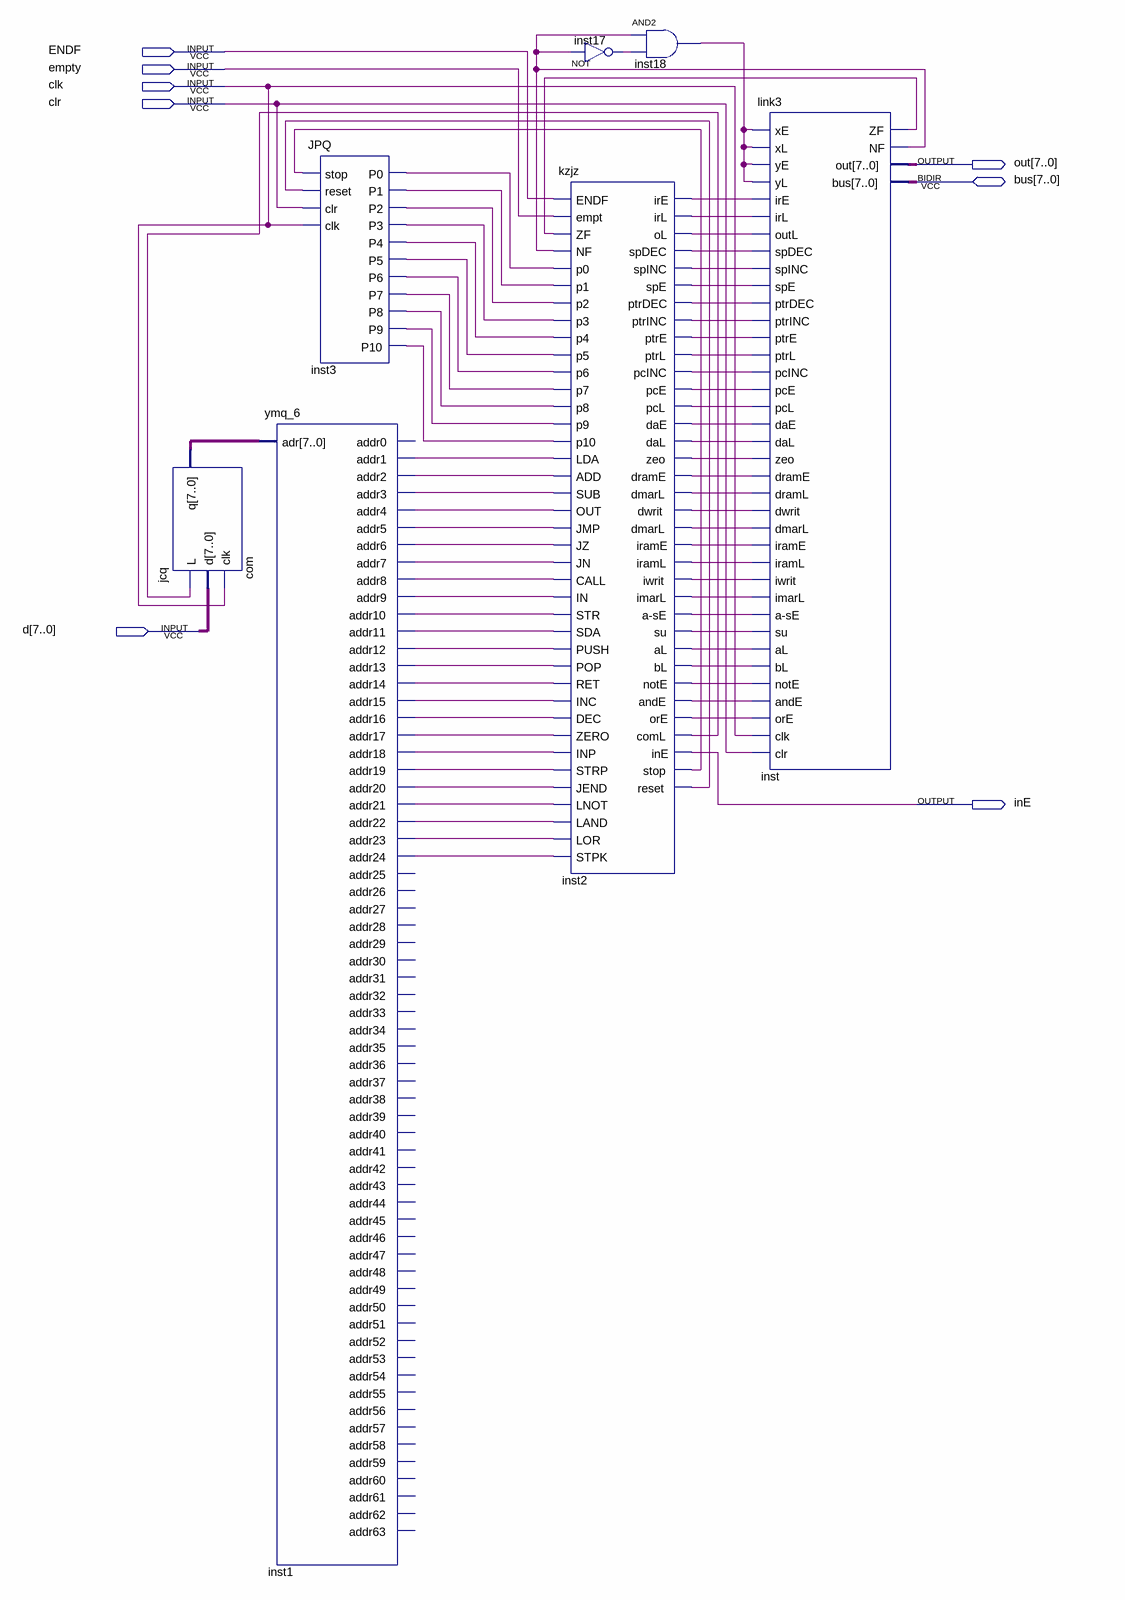
[diagram p0: schematic sheet]
// Quartus schematic top1.bdf as structural Verilog: 7 symbols, 8 pins
module top1 (
  input  ENDF,
  input  empty,
  input  clk,
  input  clr,
  input  [7:0] d,
  inout  [7:0] bus,
  output [7:0] out,
  output inE
);

  wire inst1_addr1, inst1_addr2, inst1_addr3, inst1_addr4, inst1_addr5, inst1_addr6, inst1_addr7,
       inst1_addr8, inst1_addr9, inst1_addr10, inst1_addr11, inst1_addr12, inst1_addr13, inst1_addr14,
       inst1_addr15, inst1_addr16, inst1_addr17, inst1_addr18, inst1_addr19, inst1_addr20, inst1_addr21,
       inst1_addr22, inst1_addr23, inst1_addr24, inst2_a_se, inst2_al, inst2_ande, inst2_bl, inst2_coml,
       inst2_dae, inst2_dal, inst2_dmarl, inst2_dmarl_2, inst2_drame, inst2_dwrit, inst2_imarl, inst2_irame,
       inst2_iraml, inst2_ire, inst2_irl, inst2_iwrit, inst2_note, inst2_ol, inst2_ore, inst2_pce,
       inst2_pcinc, inst2_pcl, inst2_ptrdec, inst2_ptre, inst2_ptrinc, inst2_ptrl, inst2_reset, inst2_spdec,
       inst2_spe, inst2_spinc, inst2_stop, inst2_su, inst2_zeo, inst3_p0, inst3_p1, inst3_p2, inst3_p3,
       inst3_p4, inst3_p5, inst3_p6, inst3_p7, inst3_p8, inst3_p9, inst3_p10, inst17_out, inst18_out,
       inst_nf, inst_zf;
  wire [7:0] com_q;

  jcq com (.L(inst2_coml), .d(d), .clk(clk), .q(com_q));
  JPQ inst3 (
    .stop(inst2_stop), .reset(inst2_reset), .clr(clr), .clk(clk), .P0(inst3_p0), .P1(inst3_p1),
    .P2(inst3_p2), .P3(inst3_p3), .P4(inst3_p4), .P5(inst3_p5), .P6(inst3_p6), .P7(inst3_p7), .P8(inst3_p8),
    .P9(inst3_p9), .P10(inst3_p10));
  ymq_6 inst1 (
    .adr(com_q), .addr1(inst1_addr1), .addr2(inst1_addr2), .addr3(inst1_addr3), .addr4(inst1_addr4),
    .addr5(inst1_addr5), .addr6(inst1_addr6), .addr7(inst1_addr7), .addr8(inst1_addr8), .addr9(inst1_addr9),
    .addr10(inst1_addr10), .addr11(inst1_addr11), .addr12(inst1_addr12), .addr13(inst1_addr13),
    .addr14(inst1_addr14), .addr15(inst1_addr15), .addr16(inst1_addr16), .addr17(inst1_addr17),
    .addr18(inst1_addr18), .addr19(inst1_addr19), .addr20(inst1_addr20), .addr21(inst1_addr21),
    .addr22(inst1_addr22), .addr23(inst1_addr23), .addr24(inst1_addr24));  // open: addr0, addr25, addr26, addr27, addr28, addr29, addr30, addr31, addr32, addr33, addr34, addr35, addr36, addr37, addr38, addr39, addr40, addr41, addr42, addr43, addr44, addr45, addr46, addr47, addr48, addr49, addr50, addr51, addr52, addr53, addr54, addr55, addr56, addr57, addr58, addr59, addr60, addr61, addr62, addr63
  not inst17 (inst17_out, inst_nf);
  kzjz inst2 (
    .ENDF(ENDF), .empt(empty), .ZF(inst_zf), .NF(inst_nf), .p0(inst3_p0), .p1(inst3_p1), .p2(inst3_p2),
    .p3(inst3_p3), .p4(inst3_p4), .p5(inst3_p5), .p6(inst3_p6), .p7(inst3_p7), .p8(inst3_p8), .p9(inst3_p9),
    .p10(inst3_p10), .LDA(inst1_addr1), .ADD(inst1_addr2), .SUB(inst1_addr3), .OUT(inst1_addr4),
    .JMP(inst1_addr5), .JZ(inst1_addr6), .JN(inst1_addr7), .CALL(inst1_addr8), .IN(inst1_addr9),
    .STR(inst1_addr10), .SDA(inst1_addr11), .PUSH(inst1_addr12), .POP(inst1_addr13), .RET(inst1_addr14),
    .INC(inst1_addr15), .DEC(inst1_addr16), .ZERO(inst1_addr17), .INP(inst1_addr18), .STRP(inst1_addr19),
    .JEND(inst1_addr20), .LNOT(inst1_addr21), .LAND(inst1_addr22), .LOR(inst1_addr23), .STPK(inst1_addr24),
    .irE(inst2_ire), .irL(inst2_irl), .oL(inst2_ol), .spDEC(inst2_spdec), .spINC(inst2_spinc),
    .spE(inst2_spe), .ptrDEC(inst2_ptrdec), .ptrINC(inst2_ptrinc), .ptrE(inst2_ptre), .ptrL(inst2_ptrl),
    .pcINC(inst2_pcinc), .pcE(inst2_pce), .pcL(inst2_pcl), .daE(inst2_dae), .daL(inst2_dal), .zeo(inst2_zeo),
    .dramE(inst2_drame), .dmarL({inst2_dmarl, inst2_dmarl_2}), .dwrit(inst2_dwrit), .iramE(inst2_irame),
    .iramL(inst2_iraml), .iwrit(inst2_iwrit), .imarL(inst2_imarl), .\a-sE (inst2_a_se), .su(inst2_su),
    .aL(inst2_al), .bL(inst2_bl), .notE(inst2_note), .andE(inst2_ande), .orE(inst2_ore), .comL(inst2_coml),
    .inE(inE), .stop(inst2_stop), .reset(inst2_reset));
  and inst18 (inst18_out, inst_nf, inst17_out);
  link3 inst (
    .xE(inst18_out), .xL(inst18_out), .yE(inst18_out), .yL(inst18_out), .irE(inst2_ire), .irL(inst2_irl),
    .outL(inst2_ol), .spDEC(inst2_spdec), .spINC(inst2_spinc), .spE(inst2_spe), .ptrDEC(inst2_ptrdec),
    .ptrINC(inst2_ptrinc), .ptrE(inst2_ptre), .ptrL(inst2_ptrl), .pcINC(inst2_pcinc), .pcE(inst2_pce),
    .pcL(inst2_pcl), .daE(inst2_dae), .daL(inst2_dal), .zeo(inst2_zeo), .dramE(inst2_drame),
    .dramL(inst2_dmarl), .dwrit(inst2_dwrit), .dmarL(inst2_dmarl_2), .iramE(inst2_irame),
    .iramL(inst2_iraml), .iwrit(inst2_iwrit), .imarL(inst2_imarl), .\a-sE (inst2_a_se), .su(inst2_su),
    .aL(inst2_al), .bL(inst2_bl), .notE(inst2_note), .andE(inst2_ande), .orE(inst2_ore), .clk(clk),
    .clr(clr), .ZF(inst_zf), .NF(inst_nf), .out(out), .bus(bus));
endmodule
